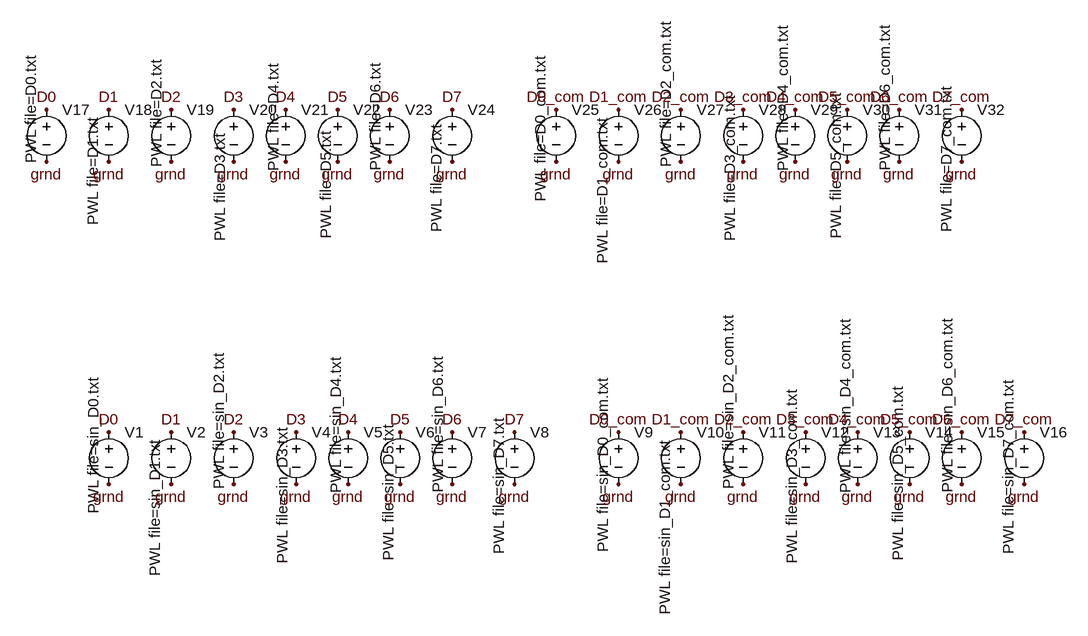
[diagram p0: schematic digital inputs.asc]
digital inputs.asc, the LTspice schematic file:
Version 4
SHEET 1 1112 680
FLAG -768 224 grnd
FLAG -672 224 grnd
FLAG -576 224 grnd
FLAG -480 224 grnd
FLAG -400 224 grnd
FLAG -320 224 grnd
FLAG -240 224 grnd
FLAG -144 224 grnd
FLAG -768 144 D0
FLAG -672 144 D1
FLAG -576 144 D2
FLAG -480 144 D3
FLAG -400 144 D4
FLAG -320 144 D5
FLAG -240 144 D6
FLAG -144 144 D7
FLAG 16 224 grnd
FLAG 112 224 grnd
FLAG 208 224 grnd
FLAG 304 224 grnd
FLAG 384 224 grnd
FLAG 464 224 grnd
FLAG 544 224 grnd
FLAG 640 224 grnd
FLAG 16 144 D0_com
FLAG 112 144 D1_com
FLAG 208 144 D2_com
FLAG 304 144 D3_com
FLAG 384 144 D4_com
FLAG 464 144 D5_com
FLAG 544 144 D6_com
FLAG 640 144 D7_com
FLAG -864 -272 grnd
FLAG -768 -272 grnd
FLAG -672 -272 grnd
FLAG -576 -272 grnd
FLAG -496 -272 grnd
FLAG -416 -272 grnd
FLAG -336 -272 grnd
FLAG -240 -272 grnd
FLAG -864 -352 D0
FLAG -768 -352 D1
FLAG -672 -352 D2
FLAG -576 -352 D3
FLAG -496 -352 D4
FLAG -416 -352 D5
FLAG -336 -352 D6
FLAG -240 -352 D7
FLAG -80 -272 grnd
FLAG 16 -272 grnd
FLAG 112 -272 grnd
FLAG 208 -272 grnd
FLAG 288 -272 grnd
FLAG 368 -272 grnd
FLAG 448 -272 grnd
FLAG 544 -272 grnd
FLAG -80 -352 D0_com
FLAG 16 -352 D1_com
FLAG 112 -352 D2_com
FLAG 208 -352 D3_com
FLAG 288 -352 D4_com
FLAG 368 -352 D5_com
FLAG 448 -352 D6_com
FLAG 544 -352 D7_com
SYMBOL voltage -768 128 R0
WINDOW 3 -24 -68 VRight 2
WINDOW 123 0 0 Left 0
WINDOW 39 0 0 Left 0
SYMATTR Value PWL file=sin_D0.txt
SYMATTR InstName V1
SYMBOL voltage -672 128 R0
WINDOW 3 -25 28 VRight 2
WINDOW 123 0 0 Left 0
WINDOW 39 0 0 Left 0
SYMATTR Value PWL file=sin_D1.txt
SYMATTR InstName V2
SYMBOL voltage -576 128 R0
WINDOW 3 -23 105 VLeft 2
WINDOW 123 0 0 Left 0
WINDOW 39 0 0 Left 0
SYMATTR Value PWL file=sin_D2.txt
SYMATTR InstName V3
SYMBOL voltage -480 128 R0
WINDOW 3 -21 219 VLeft 2
WINDOW 123 0 0 Left 0
WINDOW 39 0 0 Left 0
SYMATTR Value PWL file=sin_D3.txt
SYMATTR InstName V4
SYMBOL voltage -400 128 R0
WINDOW 3 -19 111 VLeft 2
WINDOW 123 0 0 Left 0
WINDOW 39 0 0 Left 0
SYMATTR Value PWL file=sin_D4.txt
SYMATTR InstName V5
SYMBOL voltage -320 128 R0
WINDOW 3 -18 215 VLeft 2
WINDOW 123 0 0 Left 0
WINDOW 39 0 0 Left 0
SYMATTR Value PWL file=sin_D5.txt
SYMATTR InstName V6
SYMBOL voltage -240 128 R0
WINDOW 3 -22 110 VLeft 2
WINDOW 123 0 0 Left 0
WINDOW 39 0 0 Left 0
SYMATTR Value PWL file=sin_D6.txt
SYMATTR InstName V7
SYMBOL voltage -144 128 R0
WINDOW 3 -24 205 VLeft 2
WINDOW 123 0 0 Left 0
WINDOW 39 0 0 Left 0
SYMATTR Value PWL file=sin_D7.txt
SYMATTR InstName V8
SYMBOL voltage 16 128 R0
WINDOW 3 -24 -68 VRight 2
WINDOW 123 0 0 Left 0
WINDOW 39 0 0 Left 0
SYMATTR Value PWL file=sin_D0_com.txt
SYMATTR InstName V9
SYMBOL voltage 112 128 R0
WINDOW 3 -25 28 VRight 2
WINDOW 123 0 0 Left 0
WINDOW 39 0 0 Left 0
SYMATTR Value PWL file=sin_D1_com.txt
SYMATTR InstName V10
SYMBOL voltage 208 128 R0
WINDOW 3 -23 105 VLeft 2
WINDOW 123 0 0 Left 0
WINDOW 39 0 0 Left 0
SYMATTR Value PWL file=sin_D2_com.txt
SYMATTR InstName V11
SYMBOL voltage 304 128 R0
WINDOW 3 -21 219 VLeft 2
WINDOW 123 0 0 Left 0
WINDOW 39 0 0 Left 0
SYMATTR Value PWL file=sin_D3_com.txt
SYMATTR InstName V12
SYMBOL voltage 384 128 R0
WINDOW 3 -19 111 VLeft 2
WINDOW 123 0 0 Left 0
WINDOW 39 0 0 Left 0
SYMATTR Value PWL file=sin_D4_com.txt
SYMATTR InstName V13
SYMBOL voltage 464 128 R0
WINDOW 3 -18 215 VLeft 2
WINDOW 123 0 0 Left 0
WINDOW 39 0 0 Left 0
SYMATTR Value PWL file=sin_D5_com.txt
SYMATTR InstName V14
SYMBOL voltage 544 128 R0
WINDOW 3 -22 110 VLeft 2
WINDOW 123 0 0 Left 0
WINDOW 39 0 0 Left 0
SYMATTR Value PWL file=sin_D6_com.txt
SYMATTR InstName V15
SYMBOL voltage 640 128 R0
WINDOW 3 -24 205 VLeft 2
WINDOW 123 0 0 Left 0
WINDOW 39 0 0 Left 0
SYMATTR Value PWL file=sin_D7_com.txt
SYMATTR InstName V16
SYMBOL voltage -864 -368 R0
WINDOW 3 -24 -68 VRight 2
WINDOW 123 0 0 Left 0
WINDOW 39 0 0 Left 0
SYMATTR Value PWL file=D0.txt
SYMATTR InstName V17
SYMBOL voltage -768 -368 R0
WINDOW 3 -25 28 VRight 2
WINDOW 123 0 0 Left 0
WINDOW 39 0 0 Left 0
SYMATTR Value PWL file=D1.txt
SYMATTR InstName V18
SYMBOL voltage -672 -368 R0
WINDOW 3 -23 105 VLeft 2
WINDOW 123 0 0 Left 0
WINDOW 39 0 0 Left 0
SYMATTR Value PWL file=D2.txt
SYMATTR InstName V19
SYMBOL voltage -576 -368 R0
WINDOW 3 -21 219 VLeft 2
WINDOW 123 0 0 Left 0
WINDOW 39 0 0 Left 0
SYMATTR Value PWL file=D3.txt
SYMATTR InstName V20
SYMBOL voltage -496 -368 R0
WINDOW 3 -19 111 VLeft 2
WINDOW 123 0 0 Left 0
WINDOW 39 0 0 Left 0
SYMATTR Value PWL file=D4.txt
SYMATTR InstName V21
SYMBOL voltage -416 -368 R0
WINDOW 3 -18 215 VLeft 2
WINDOW 123 0 0 Left 0
WINDOW 39 0 0 Left 0
SYMATTR Value PWL file=D5.txt
SYMATTR InstName V22
SYMBOL voltage -336 -368 R0
WINDOW 3 -22 110 VLeft 2
WINDOW 123 0 0 Left 0
WINDOW 39 0 0 Left 0
SYMATTR Value PWL file=D6.txt
SYMATTR InstName V23
SYMBOL voltage -240 -368 R0
WINDOW 3 -24 205 VLeft 2
WINDOW 123 0 0 Left 0
WINDOW 39 0 0 Left 0
SYMATTR Value PWL file=D7.txt
SYMATTR InstName V24
SYMBOL voltage -80 -368 R0
WINDOW 3 -24 -68 VRight 2
WINDOW 123 0 0 Left 0
WINDOW 39 0 0 Left 0
SYMATTR Value PWL file=D0_com.txt
SYMATTR InstName V25
SYMBOL voltage 16 -368 R0
WINDOW 3 -25 28 VRight 2
WINDOW 123 0 0 Left 0
WINDOW 39 0 0 Left 0
SYMATTR Value PWL file=D1_com.txt
SYMATTR InstName V26
SYMBOL voltage 112 -368 R0
WINDOW 3 -23 105 VLeft 2
WINDOW 123 0 0 Left 0
WINDOW 39 0 0 Left 0
SYMATTR Value PWL file=D2_com.txt
SYMATTR InstName V27
SYMBOL voltage 208 -368 R0
WINDOW 3 -21 219 VLeft 2
WINDOW 123 0 0 Left 0
WINDOW 39 0 0 Left 0
SYMATTR Value PWL file=D3_com.txt
SYMATTR InstName V28
SYMBOL voltage 288 -368 R0
WINDOW 3 -19 111 VLeft 2
WINDOW 123 0 0 Left 0
WINDOW 39 0 0 Left 0
SYMATTR Value PWL file=D4_com.txt
SYMATTR InstName V29
SYMBOL voltage 368 -368 R0
WINDOW 3 -18 215 VLeft 2
WINDOW 123 0 0 Left 0
WINDOW 39 0 0 Left 0
SYMATTR Value PWL file=D5_com.txt
SYMATTR InstName V30
SYMBOL voltage 448 -368 R0
WINDOW 3 -22 110 VLeft 2
WINDOW 123 0 0 Left 0
WINDOW 39 0 0 Left 0
SYMATTR Value PWL file=D6_com.txt
SYMATTR InstName V31
SYMBOL voltage 544 -368 R0
WINDOW 3 -24 205 VLeft 2
WINDOW 123 0 0 Left 0
WINDOW 39 0 0 Left 0
SYMATTR Value PWL file=D7_com.txt
SYMATTR InstName V32

The netlist it stands for:
* digital inputs.asc
V1 D0 grnd PWL file=sin_D0.txt
V2 D1 grnd PWL file=sin_D1.txt
V3 D2 grnd PWL file=sin_D2.txt
V4 D3 grnd PWL file=sin_D3.txt
V5 D4 grnd PWL file=sin_D4.txt
V6 D5 grnd PWL file=sin_D5.txt
V7 D6 grnd PWL file=sin_D6.txt
V8 D7 grnd PWL file=sin_D7.txt
V9 D0_com grnd PWL file=sin_D0_com.txt
V10 D1_com grnd PWL file=sin_D1_com.txt
V11 D2_com grnd PWL file=sin_D2_com.txt
V12 D3_com grnd PWL file=sin_D3_com.txt
V13 D4_com grnd PWL file=sin_D4_com.txt
V14 D5_com grnd PWL file=sin_D5_com.txt
V15 D6_com grnd PWL file=sin_D6_com.txt
V16 D7_com grnd PWL file=sin_D7_com.txt
V17 D0 grnd PWL file=D0.txt
V18 D1 grnd PWL file=D1.txt
V19 D2 grnd PWL file=D2.txt
V20 D3 grnd PWL file=D3.txt
V21 D4 grnd PWL file=D4.txt
V22 D5 grnd PWL file=D5.txt
V23 D6 grnd PWL file=D6.txt
V24 D7 grnd PWL file=D7.txt
V25 D0_com grnd PWL file=D0_com.txt
V26 D1_com grnd PWL file=D1_com.txt
V27 D2_com grnd PWL file=D2_com.txt
V28 D3_com grnd PWL file=D3_com.txt
V29 D4_com grnd PWL file=D4_com.txt
V30 D5_com grnd PWL file=D5_com.txt
V31 D6_com grnd PWL file=D6_com.txt
V32 D7_com grnd PWL file=D7_com.txt
.backanno
.end